# Altium schematic sheet V1.0.SchDoc
size 63 x 38 mm
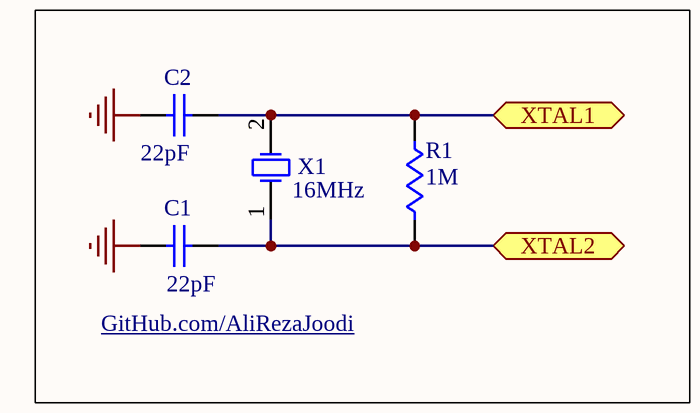
[diagram p0: V1.0.SchDoc]

## Parts
C1  22pF  [CAPNTO2.54-3.05x1.78A]
C2  22pF  [CAPNTO2.54-3.05x1.78A]
R1  1M  [AXIAL-0.4]
X1  16MHz  [XTAL_1]

## Ports
XTAL1, XTAL2

## Nets
GND: C1.2 C2.2
XTAL1: C2.1 R1.2 X1.2(OSC2) ; port XTAL1
XTAL2: C1.1 R1.1 X1.1(OSC1) ; port XTAL2

## Notes on the sheet
- GitHub.com/AliRezaJoodi

## Library data of the parts
C1 C2 = Cap: Capacitor; Manufacturer: Generic Components; Class I: Passive; Published: 8-Jun-2000; Revision: July-2002: Re-released for DXP Platform.; Publisher: Altium Limited; Class II: Capacitor
R1 = Res1: Resistor; Manufacturer: Generic Components; Class I: Passive; Published: 8-Jun-2000; Revision: July-2002: Re-released for DXP Platform.; Publisher: Altium Limited; Class II: Resistor
X1 = XTAL: Crystal Oscillator; Manufacturer: Generic Components; Published: 8-Jun-2000; Revision: July-2002: Re-released for DXP Platform.; Publisher: Altium Limited; Class I: Oscillator; Class II: Crystal Oscillator